# Altium schematic sheet driver_sapog_compact.SchDoc
size A0; Organization: Altium Limited; Address1: L3, 12a Rodborough Rd; Address2: Frenchs Forest; Address3: NSW; Address4: Australia 2086
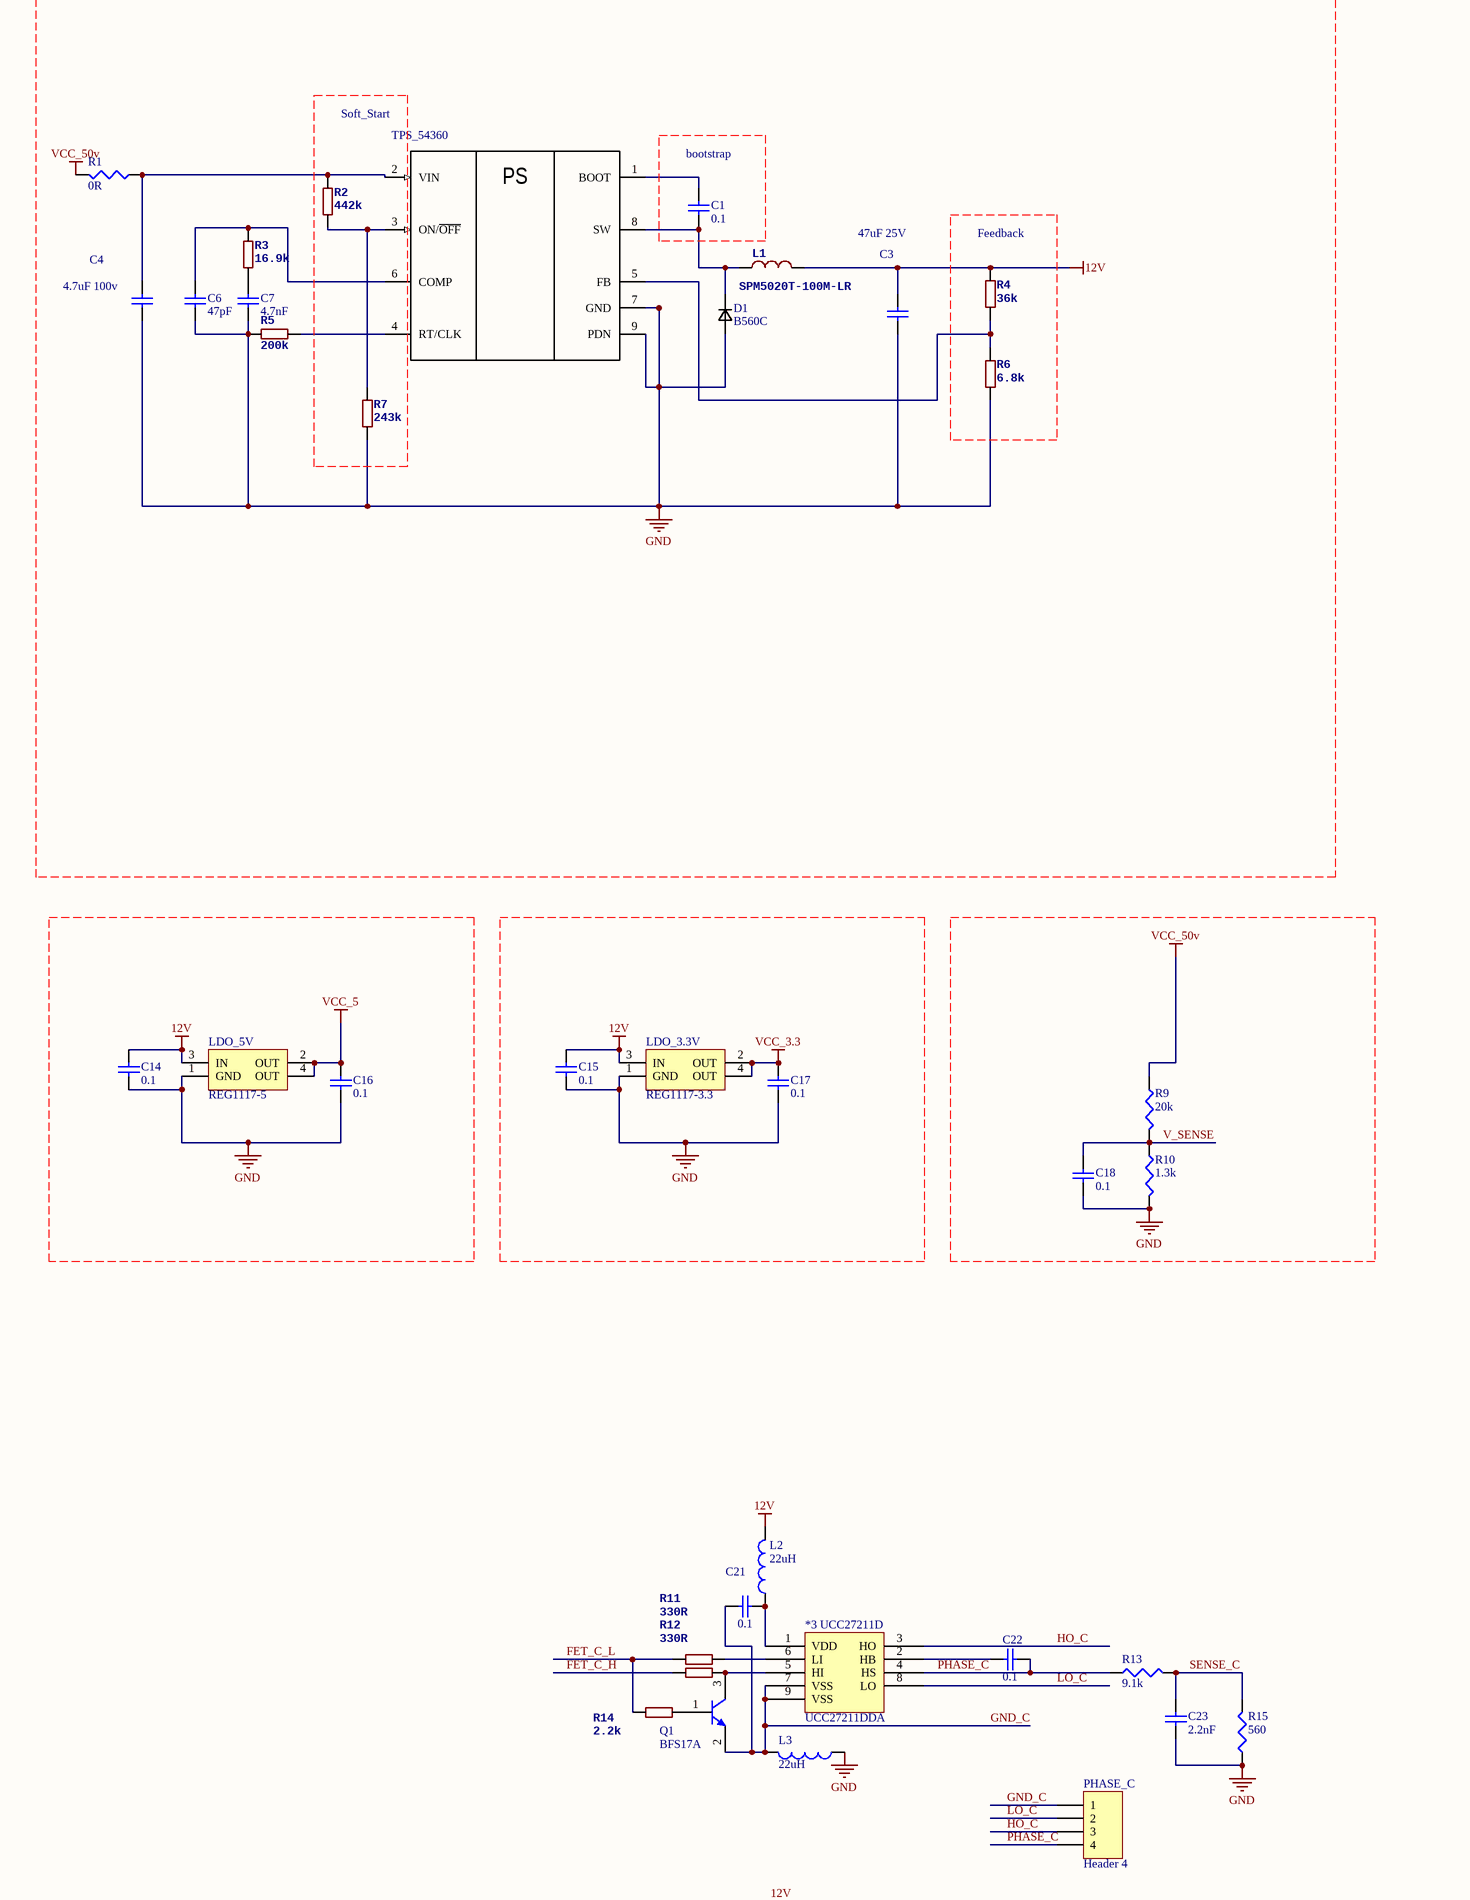
[diagram p0: driver_sapog_compact.SchDoc, top left]
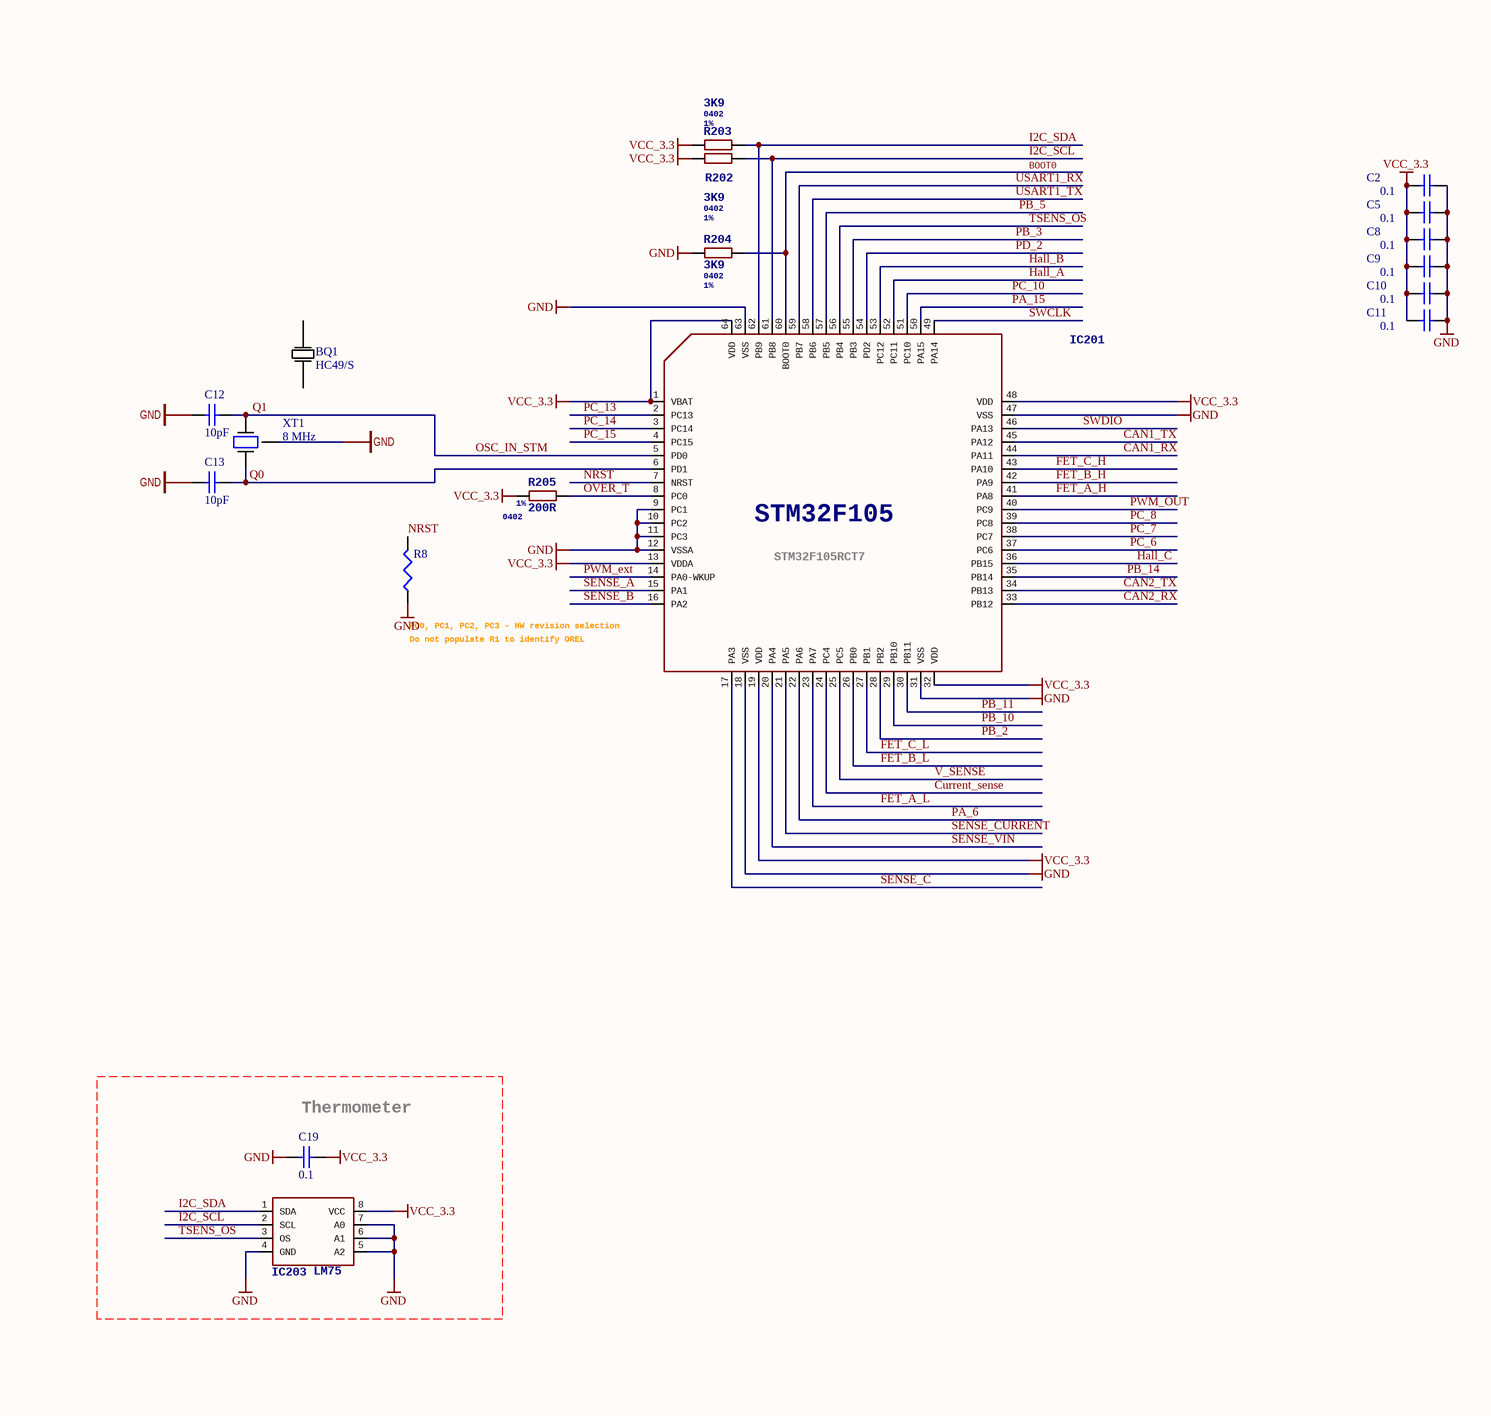
[diagram p1: driver_sapog_compact.SchDoc, top middle]
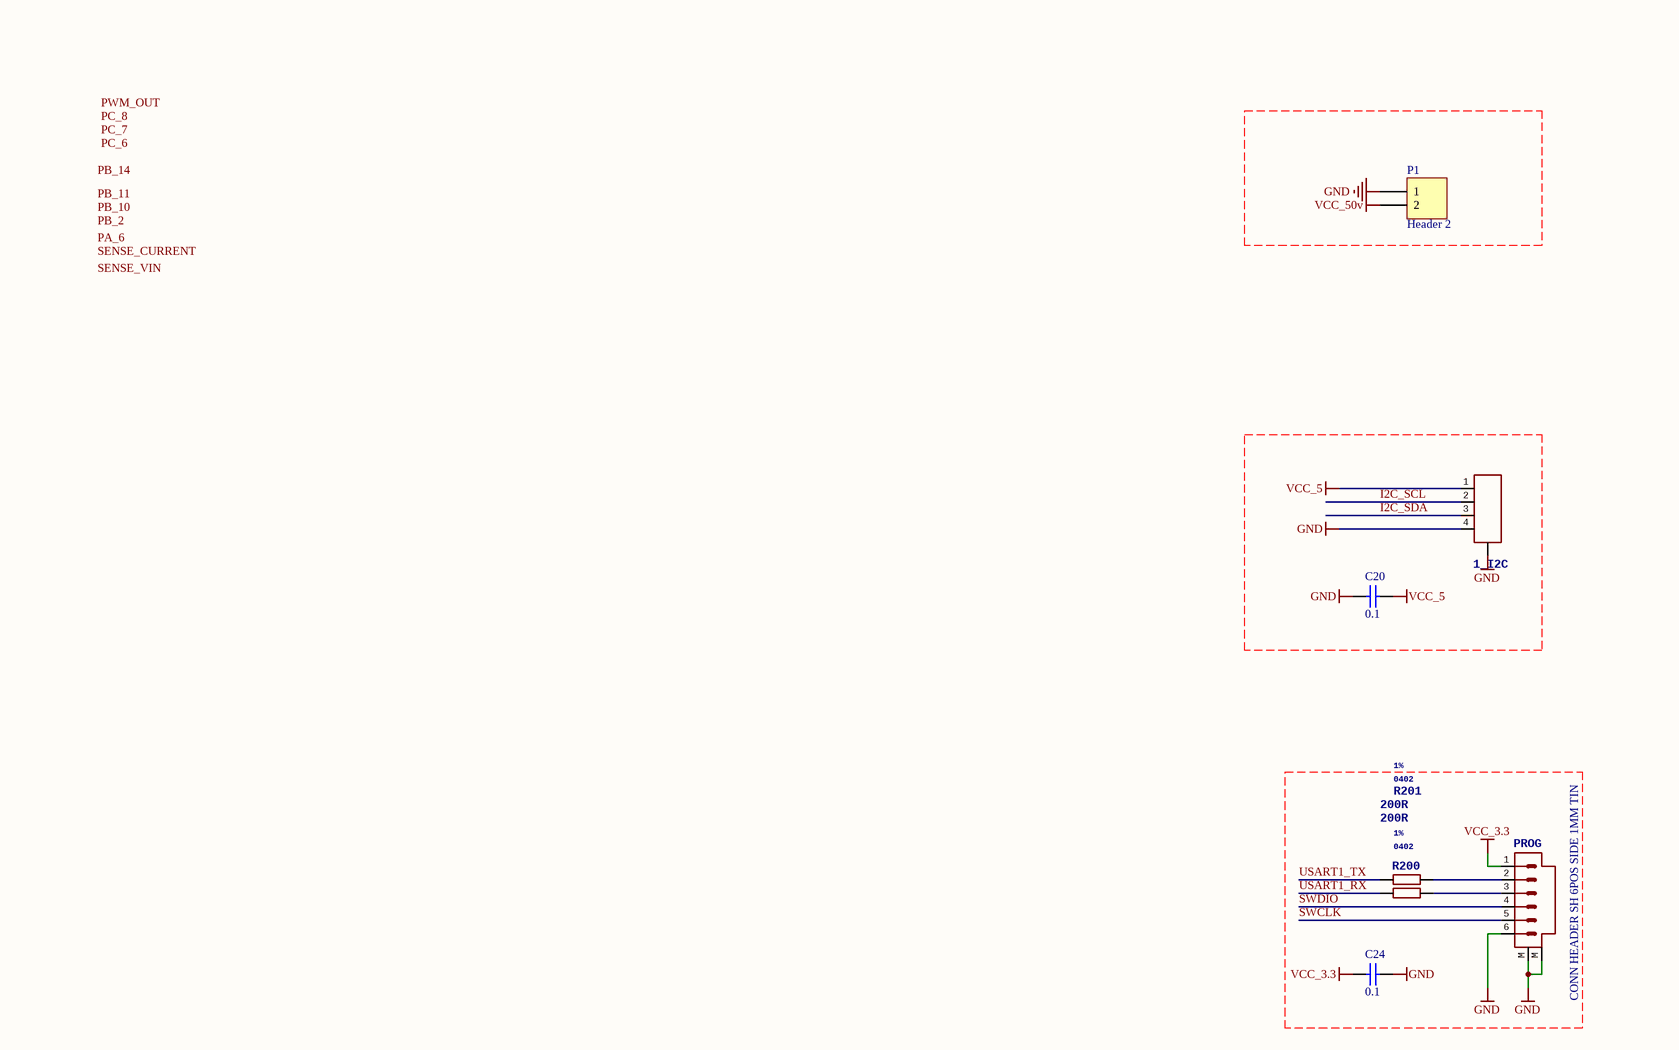
[diagram p2: driver_sapog_compact.SchDoc, top right]
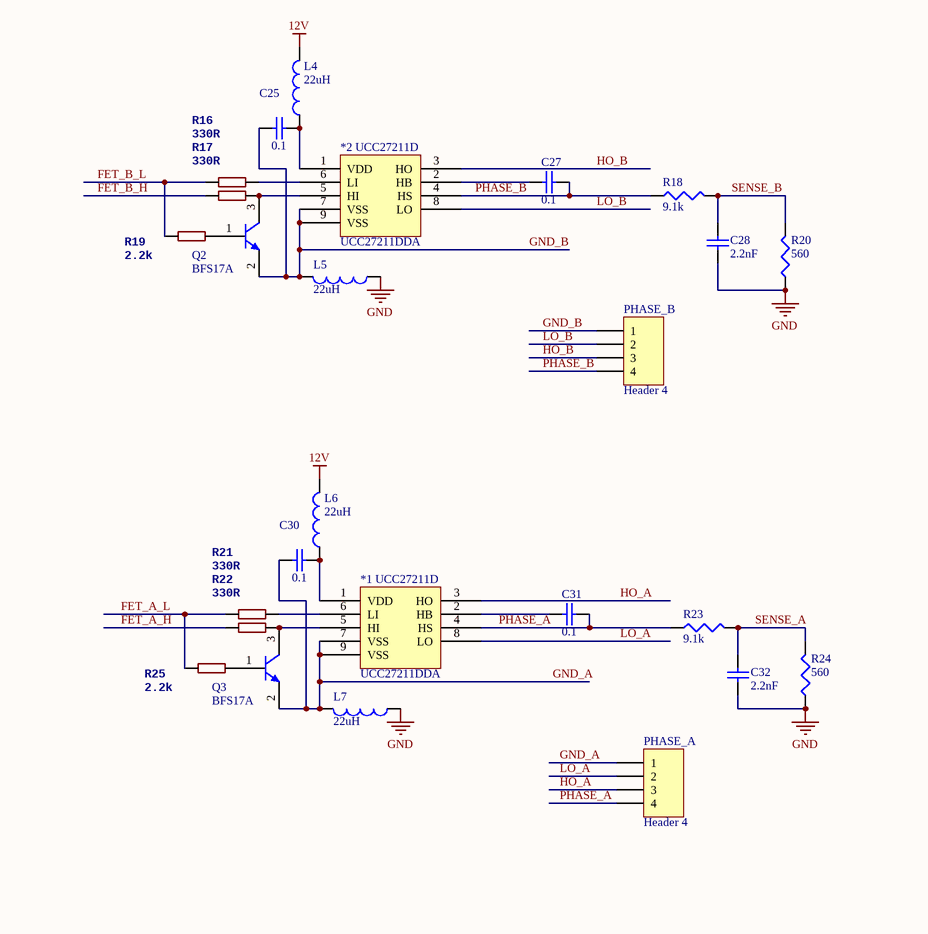
[diagram p3: driver_sapog_compact.SchDoc, bottom left]
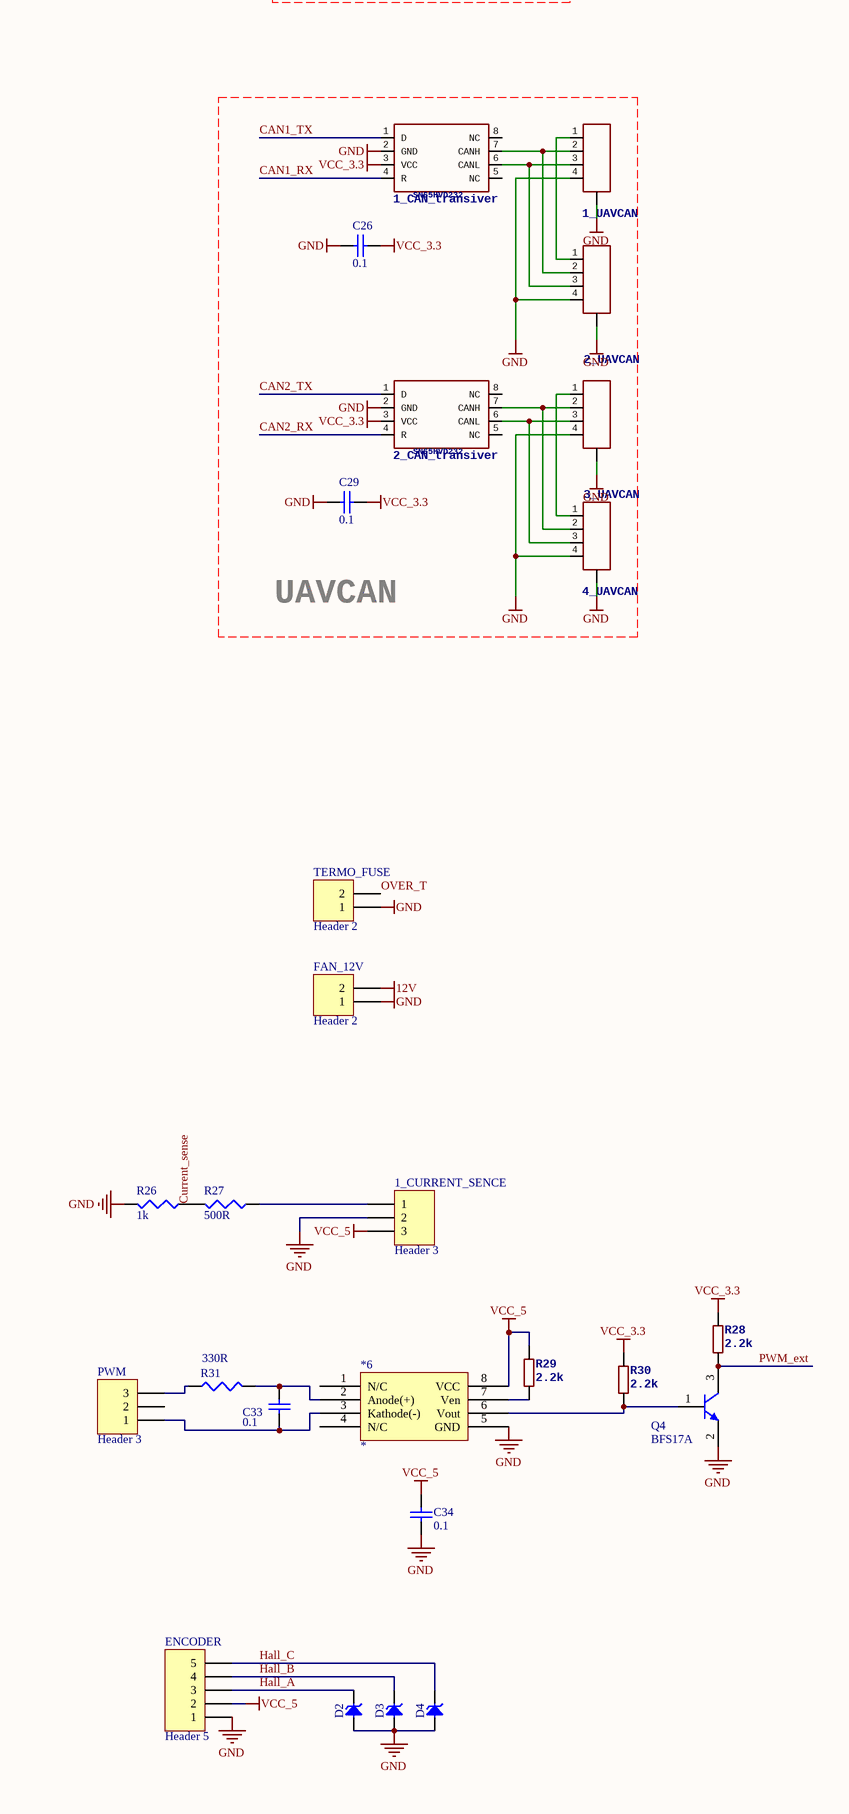
[diagram p4: driver_sapog_compact.SchDoc, bottom right]

## Parts
1_CAN_transiver  SN65HVD232D  [SOIC8]  (value not drawn)
1_CURRENT_SENCE  Header 3  [HDR1X3]
1_I2C  CON-4P-RA  [JST_GH-4P-RA]  (value not drawn)
1_UAVCAN  CON-4P-RA  [JST_GH-4P-RA]  (value not drawn)
2_CAN_transiver  SN65HVD232D  [SOIC8]  (value not drawn)
2_UAVCAN  CON-4P-RA  [JST_GH-4P-RA]  (value not drawn)
3_UAVCAN  CON-4P-RA  [JST_GH-4P-RA]  (value not drawn)
4_UAVCAN  CON-4P-RA  [JST_GH-4P-RA]  (value not drawn)
*1_UCC27211D  UCC27211DDA  [D8_L_G]
*2_UCC27211D  UCC27211DDA  [D8_L_G]
*3_UCC27211D  UCC27211DDA  [D8_L_G]
*6  *  [UCC37322P]
BQ1  HC49/S  [HS49/S]
C1  0.1  [1608[0603]]
C2  0.1  [SMT0603/VISHAY]
C3  value 47uF 25V  [2220]  (hidden comment: 1206)
C4  value 4.7uF 100v  [2220]  (hidden comment: 2220)
C5  0.1  [SMT0603/VISHAY]
C6  47pF  [SMT0603/VISHAY]
C7  4.7nF  [SMT0603/VISHAY]
C8  0.1  [SMT0603/VISHAY]
C9  0.1  [SMT0603/VISHAY]
C10  0.1  [SMT0603/VISHAY]
C11  0.1  [SMT0603/VISHAY]
C12  10pF  [SMT0603/VISHAY]
C13  10pF  [SMT0603/VISHAY]
C14  0.1  [SMT0603/VISHAY]
C15  0.1  [SMT0603/VISHAY]
C16  0.1  [SMT0603/VISHAY]
C17  0.1  [SMT0603/VISHAY]
C18  0.1  [SMT0603/VISHAY]
C19  0.1  [SMT0603/VISHAY]
C20  0.1  [SMT0603/VISHAY]
C21  0.1  [2220]
C22  0.1  [2220]
C23  2.2nF  [SMT0603/VISHAY]
C24  0.1  [SMT0603/VISHAY]
C25  0.1  [2220]
C26  0.1  [SMT0603/VISHAY]
C27  0.1  [2220]
C28  2.2nF  [SMT0603/VISHAY]
C29  0.1  [SMT0603/VISHAY]
C30  0.1  [2220]
C31  0.1  [2220]
C32  2.2nF  [SMT0603/VISHAY]
C33  0.1  [SMT0603/VISHAY]
C34  0.1  [SMT0603/VISHAY]
D1  B560C  [SMC]
D2  BZV55-B13  [3.2x1.6x1.1]  (value not drawn)
D3  BZV55-B13  [3.2x1.6x1.1]  (value not drawn)
D4  BZV55-B13  [3.2x1.6x1.1]  (value not drawn)
ENCODER  Header 5  [jst_gh_6_pin]
FAN_12V  Header 2  [HDR1X2]
IC201  STM32F105  [TQFP64-10X10]
IC203  LM75BD-TSSOP8  [TSSOP8]  (value not drawn)
L1  SPM5020T-100M-LR  [Inductor]
L2  22uH  [0805]
L3  22uH  [0805]
L4  22uH  [0805]
L5  22uH  [0805]
L6  22uH  [0805]
L7  22uH  [0805]
LDO_3.3V  REG1117-3.3  [ZZ311]
LDO_5V  REG1117-5  [ZZ311]
P1  Header 2  [HDR1X2]
PHASE_A  Header 4  [HDR1X4]
PHASE_B  Header 4  [HDR1X4]
PHASE_C  Header 4  [HDR1X4]
PROG  CONN HEADER SH 6POS SIDE 1MM TIN  [HIROSE DF13-6P-1.25H]
PWM  Header 3  [HDR1X3]
Q1  BFS17A  [SOT-23_N]
Q2  BFS17A  [SOT-23_N]
Q3  BFS17A  [SOT-23_N]
Q4  BFS17A  [SOT-23_N]
R1  value 0R  [14-1210]  (hidden comment: 1210)
R2  442k  [SMT0603/VISHAY]
R3  16.9k  [SMT0603/VISHAY]
R4  36k  [SMT0603/VISHAY]
R5  200k  [SMT0603/VISHAY]
R6  6.8k  [SMT0603/VISHAY]
R7  243k  [SMT0603/VISHAY]
R8  Res3  [SMT0603/VISHAY]  (value not drawn)
R9  value 20k  [SMT0603/VISHAY]  (hidden comment: 10k)
R10  value 1.3k  [SMT0603/VISHAY]  (hidden comment: 1k)
R11  330R  [1608[0603]]
R12  330R  [1608[0603]]
R13  9.1k  [SMT0603/VISHAY]
R14  2.2k  [1608[0603]]
R15  value 560  [SMT0603/VISHAY]  (hidden comment: 560R)
R16  330R  [1608[0603]]
R17  330R  [1608[0603]]
R18  9.1k  [SMT0603/VISHAY]
R19  2.2k  [1608[0603]]
R20  value 560  [SMT0603/VISHAY]  (hidden comment: 560R)
R21  330R  [1608[0603]]
R22  330R  [1608[0603]]
R23  9.1k  [SMT0603/VISHAY]
R24  value 560  [SMT0603/VISHAY]  (hidden comment: 560R)
R25  2.2k  [1608[0603]]
R26  1k  [SMT0603/VISHAY]
R27  value 500R  [SMT0603/VISHAY]  (hidden comment: 560R)
R28  2.2k  [1608[0603]]
R29  2.2k  [1608[0603]]
R30  2.2k  [1608[0603]]
R31  330R  [SMT0603/VISHAY]
R200  200R  PACKAGE: 0402  TOLERANCE: 1%  [SMT0603/VISHAY]
R201  200R  PACKAGE: 0402  TOLERANCE: 1%  [SMT0603/VISHAY]
R202  3K9  PACKAGE: 0402  TOLERANCE: 1%  [SMT0603/VISHAY]
R203  3K9  PACKAGE: 0402  TOLERANCE: 1%  [SMT0603/VISHAY]
R204  3K9  PACKAGE: 0402  TOLERANCE: 1%  [SMT0603/VISHAY]
R205  200R  PACKAGE: 0402  TOLERANCE: 1%  [SMT0603/VISHAY]
TERMO_FUSE  Header 2  [HDR1X2]
TPS_54360  (no value)  [D8_L_G]
XT1  8 MHz  [DFN220P320X110-4N]

## Nets
12V: C3.2 C14.2 C15.2 FAN_12V.2 L1.2 L2.2 L4.2 L6.2 LDO_3.3V.3(IN) LDO_5V.3(IN) R4.2
GND: 1_CAN_transiver.2(GND) 1_CURRENT_SENCE.2 1_I2C.4 1_I2C.M$0_M$1(GND) 1_UAVCAN.4 1_UAVCAN.M$0_M$1(GND) 2_CAN_transiver.2(GND) 2_UAVCAN.4 2_UAVCAN.M$0_M$1(GND) 3_UAVCAN.4 3_UAVCAN.M$0_M$1(GND) 4_UAVCAN.4 4_UAVCAN.M$0_M$1(GND) *6.5(GND) C2.1 C3.1 C4.1 C5.1 C6.2 C7.2 C8.1 C9.1 C10.1 C11.1 C12.1 C13.1 C14.1 C15.1 C16.1 C17.1 C18.1 C19.2 C20.1 C23.2 C24.2 C26.1 C28.2 C29.2 C32.2 C34.1 D1.1 D2.2(A) D3.2(A) D4.2(A) ENCODER.1 FAN_12V.1 IC201.9(PC1) IC201.10(PC2) IC201.11(PC3) IC201.12(VSSA) IC201.18(VSS) IC201.31(VSS) IC201.47(VSS) IC201.63(VSS) IC203.4(GND) IC203.5(A2) IC203.6(A1) IC203.7(A0) L3.1 L5.1 L7.1 LDO_3.3V.1(GND) LDO_5V.1(GND) P1.1 PROG.6 PROG.M Q4.2(E) R5.2 R6.1 R7.1 R8.1 R10.2 R15.1 R20.1 R24.1 R26.2 R204.1 TERMO_FUSE.1 TPS_54360.7(GND) TPS_54360.9(PDN) XT1.G
VCC_3.3: 1_CAN_transiver.3(VCC) 2_CAN_transiver.3(VCC) C2.2 C5.2 C8.2 C9.2 C10.2 C11.2 C17.2 C19.1 C24.1 C26.2 C29.1 IC201.1(VBAT) IC201.13(VDDA) IC201.19(VDD) IC201.32(VDD) IC201.48(VDD) IC201.64(VDD) IC203.8(VCC) LDO_3.3V.2(OUT) LDO_3.3V.4(OUT) PROG.1 R28.1 R30.1 R202.1 R203.1 R205.2
VCC_5: 1_CURRENT_SENCE.3 1_I2C.1 *6.8(VCC) C16.2 C20.2 C34.2 ENCODER.2 LDO_5V.2(OUT) LDO_5V.4(OUT) R29.1
VCC_50v: P1.2 R1.2 R9.1
BOOT0: IC201.60(BOOT0) R204.2
CAN1_RX: 1_CAN_transiver.4(R) IC201.44(PA11)
CAN1_TX: 1_CAN_transiver.1(D) IC201.45(PA12)
CAN2_RX: 2_CAN_transiver.4(R) IC201.33(PB12)
CAN2_TX: 2_CAN_transiver.1(D) IC201.34(PB13)
Current_sense: IC201.24(PC4) R26.1 R27.2
FET_A_H: IC201.41(PA8) R21.2
FET_A_L: IC201.23(PA7) R22.2 R25.2
FET_B_H: IC201.42(PA9) R16.2
FET_B_L: IC201.26(PB0) R17.2 R19.2
FET_C_H: IC201.43(PA10) R11.2
FET_C_L: IC201.27(PB1) R12.2 R14.2
GND_A: *1_UCC27211D.7(VSS) *1_UCC27211D.9(VSS) C30.2 L7.2 PHASE_A.1 Q3.2(E)
GND_B: *2_UCC27211D.7(VSS) *2_UCC27211D.9(VSS) C25.2 L5.2 PHASE_B.1 Q2.2(E)
GND_C: *3_UCC27211D.7(VSS) *3_UCC27211D.9(VSS) C21.2 L3.2 PHASE_C.1 Q1.2(E)
Hall_A: D2.1(C) ENCODER.3 IC201.52(PC11)
Hall_B: D3.1(C) ENCODER.4 IC201.53(PC12)
Hall_C: D4.1(C) ENCODER.5 IC201.36(PB15)
HO_A: *1_UCC27211D.3(HO) PHASE_A.3
HO_B: *2_UCC27211D.3(HO) PHASE_B.3
HO_C: *3_UCC27211D.3(HO) PHASE_C.3
I2C_SCL: 1_I2C.2 IC201.61(PB8) IC203.2(SCL) R202.2
I2C_SDA: 1_I2C.3 IC201.62(PB9) IC203.1(SDA) R203.2
LO_A: *1_UCC27211D.8(LO) PHASE_A.2
LO_B: *2_UCC27211D.8(LO) PHASE_B.2
LO_C: *3_UCC27211D.8(LO) PHASE_C.2
NRST: IC201.7(NRST) R8.2
OSC_IN_STM: C12.2 IC201.5(PD0) XT1.3  [also labelled Q1]
OVER_T: IC201.8(PC0) R205.1 TERMO_FUSE.2
PA_6: IC201.22(PA6)
PA_15: IC201.50(PA15)
PB_2: IC201.28(PB2)
PB_3: IC201.55(PB3)
PB_5: IC201.57(PB5)
PB_10: IC201.29(PB10)
PB_11: IC201.30(PB11)
PB_14: IC201.35(PB14)
PC_6: IC201.37(PC6)
PC_7: IC201.38(PC7)
PC_8: IC201.39(PC8)
PC_10: IC201.51(PC10)
PC_13: IC201.2(PC13)
PC_14: IC201.3(PC14)
PC_15: IC201.4(PC15)
PD_2: IC201.54(PD2)
PHASE_A: *1_UCC27211D.4(HS) C31.2 PHASE_A.4 R23.1
PHASE_B: *2_UCC27211D.4(HS) C27.2 PHASE_B.4 R18.1
PHASE_C: *3_UCC27211D.4(HS) C22.2 PHASE_C.4 R13.1
PWM_ext: IC201.14(PA0-WKUP) Q4.3(C) R28.2
PWM_OUT: IC201.40(PC9)
Q0: C13.2 IC201.6(PD1) XT1.1
SENSE_A: C32.1 IC201.15(PA1) R23.2 R24.2
SENSE_B: C28.1 IC201.16(PA2) R18.2 R20.2
SENSE_C: C23.1 IC201.17(PA3) R13.2 R15.2
SENSE_CURRENT: IC201.21(PA5)
SENSE_VIN: IC201.20(PA4)
SWCLK: IC201.49(PA14) PROG.5
SWDIO: IC201.46(PA13) PROG.4
TSENS_OS: IC201.56(PB4) IC203.3(OS)
USART1_RX: IC201.59(PB7) R201.2
USART1_TX: IC201.58(PB6) R200.2
V_SENSE: C18.2 IC201.25(PC5) R9.2 R10.1
Net1_CAN_transiver_6: 1_CAN_transiver.6(CANL) 1_UAVCAN.3 2_UAVCAN.3
Net1_CAN_transiver_7: 1_CAN_transiver.7(CANH) 1_UAVCAN.2 2_UAVCAN.2
Net1_CURRENT_SENCE_1: 1_CURRENT_SENCE.1 R27.1
Net1_UAVCAN_1: 1_UAVCAN.1 2_UAVCAN.1
Net2_CAN_transiver_6: 2_CAN_transiver.6(CANL) 3_UAVCAN.3 4_UAVCAN.3
Net2_CAN_transiver_7: 2_CAN_transiver.7(CANH) 3_UAVCAN.2 4_UAVCAN.2
Net3_UAVCAN_1: 3_UAVCAN.1 4_UAVCAN.1
Net*1_UCC27211D_1: *1_UCC27211D.1(VDD) C30.1 L6.1
Net*1_UCC27211D_2: *1_UCC27211D.2(HB) C31.1
Net*1_UCC27211D_5: *1_UCC27211D.5(HI) Q3.3(C) R21.1
Net*1_UCC27211D_6: *1_UCC27211D.6(LI) R22.1
Net*2_UCC27211D_1: *2_UCC27211D.1(VDD) C25.1 L4.1
Net*2_UCC27211D_2: *2_UCC27211D.2(HB) C27.1
Net*2_UCC27211D_5: *2_UCC27211D.5(HI) Q2.3(C) R16.1
Net*2_UCC27211D_6: *2_UCC27211D.6(LI) R17.1
Net*3_UCC27211D_1: *3_UCC27211D.1(VDD) C21.1 L2.1
Net*3_UCC27211D_2: *3_UCC27211D.2(HB) C22.1
Net*3_UCC27211D_5: *3_UCC27211D.5(HI) Q1.3(C) R11.1
Net*3_UCC27211D_6: *3_UCC27211D.6(LI) R12.1
Net*6_2: *6.2(Anode(+)) C33.2 R31.2
Net*6_3: *6.3(Kathode(-)) C33.1 PWM.1
Net*6_6: *6.6(Vout) Q4.1(B) R30.2
Net*6_7: *6.7(Ven) R29.2
NetC1_1: C1.1 TPS_54360.1(BOOT)
NetC1_2: C1.2 D1.2 L1.1 TPS_54360.8(SW)
NetC4_2: C4.2 R1.1 R2.2 TPS_54360.2(VIN)
NetC6_1: C6.1 R3.2 TPS_54360.6(COMP)
NetC7_1: C7.1 R3.1
NetPROG_2: PROG.2 R200.1
NetPROG_3: PROG.3 R201.1
NetPWM_3: PWM.3 R31.1
NetQ1_1: Q1.1(B) R14.1
NetQ2_1: Q2.1(B) R19.1
NetQ3_1: Q3.1(B) R25.1
NetR2_1: R2.1 R7.2 TPS_54360.3(ON/~{OFF})
NetR4_1: R4.1 R6.2 TPS_54360.5(FB)
NetR5_1: R5.1 TPS_54360.4(RT/CLK)

Not connected (* = marked no-connect by the designer): 1_CAN_transiver 5(NC) 8(NC); 2_CAN_transiver 5(NC) 8(NC); *6 1(N/C) 4(N/C); BQ1 1 2; PWM 2

## Notes on the sheet
- Soft_Start
- (near C1) bootstrap
- (near R4) Feedback
- (near IC201) STM32F105RCT7
- (near R8) PC0, PC1, PC2, PC3 - HW revision selection
- (near R8) Do not populate R1 to identify OREL
- (near C19) Thermometer
- UAVCAN
- Labels drawn without touching a wire or pin: PA_6, PB_2, PB_10, PB_11, PB_14, PC_6, PC_7, PC_8, PWM_OUT, SENSE_CURRENT, SENSE_VIN
- Title
- Size:
- Date:
- File:
- A0
- Number:
- Time:
- Revision:
- Sheet
- of
- (in symbol TPS54560) PS

## Library data of the parts
1_CAN_transiver 2_CAN_transiver = SN65HVD232D: IC CAN TRANSCEIVER 3.3V 8-SOIC; MANF: Texas Instruments; MANF#: SN65HVD232DR; DIGIKEY#: 296-26344-1-ND; SN65HVD232: SN65HVD232
1_CURRENT_SENCE PWM = Header 3: Header, 3-Pin; LatestRevisionDate: 17-Jul-2002; LatestRevisionNote: Re-released for DXP Platform.; Publisher: Altium Limited
1_I2C 1_UAVCAN 2_UAVCAN 3_UAVCAN 4_UAVCAN = CON-4P-RA: Connector Receptacle 4 Position 0.049" (1.25mm) Tin Surface Mount, Right Angle; pin to pad: M$0 M$1>M M; MANF: Molex; MANF#: 5023860470; DIGIKEY#: WM4948CT-ND
*6 = Component_1
BQ1 = HC49/S: Crystal Oscillator; PackageReference: hs_49u
C1 C2 C5-C34 = Cap Semi: Capacitor (Semiconductor SIM Model); Value: 100nF; Published: 8-Jun-2000; LatestRevisionDate: 29-May-2009; LatestRevisionNote: IPC-7351 Footprint Added.; PackageReference: C1206; Publisher: Altium Limited; PackageDescription: Chip Capacitor
C3 = Cap Semi: 100uF; Published: 8-Jun-2000; LatestRevisionDate: 29-May-2009; LatestRevisionNote: IPC-7351 Footprint Added.; PackageReference: C1206; Publisher: Altium Limited; PackageDescription: Chip Capacitor
C4 = Cap Semi: 4.7uF 100v; Published: 8-Jun-2000; LatestRevisionDate: 29-May-2009; LatestRevisionNote: IPC-7351 Footprint Added.; PackageReference: C2220; Publisher: Altium Limited; PackageDescription: Chip Capacitor
D1 = B560C: 60V 0.5A Shottcky Diode
D2-D4 = BZV55-B13: Zener Diode; pin to pad: 1>2 2>1; Part Description: Voltage Regulator Diode; Manufacturer: NXP SEMICONDUCTORS; Voltage: 13V; Power: 500mW; Table: Diodes; Part Number: BZV55-B13; Component Kind: Standard; Component Type: Standard; Device: BZV55-B13; Footprint: DIOMELF3515N; PackageDescription: SOD80C, MELF Diode, 2-Leads, Body 3.5x1.5mm, IPC Medium Density; Manufacturer Part Number: BZV55-B13; Pin Count: 2; Case: SOD-80C; Mounted: Yes; Socket: No; SMD: Yes; ComponentHeight: 1.6mm; HelpURL: \\cern.ch\dfs\Applications\Altium\Datasheets\BZV55.pdf; Author: CERN DEM JLC; CreateDate: 06/05/2008; LatestRevisionDate: 06/05/2008
ENCODER = Header 5: Header, 5-Pin; pin to pad: 1>6 2>5 3>4 4>3 5>2; LatestRevisionDate: 17-Jul-2002; LatestRevisionNote: Re-released for DXP Platform.; Publisher: Altium Limited
FAN_12V P1 TERMO_FUSE = Header 2: Header, 2-Pin; LatestRevisionDate: 17-Jul-2002; LatestRevisionNote: Re-released for DXP Platform.; Publisher: Altium Limited
IC201 = STM32F105: MCU ARM 256KB FLASH MEM 64-LQFP; MANF: STMicroelectronics; MANF#: STM32F105RCT6; OPERATING_TEMP: -40°C ~ 105°C (TA); DIGIKEY#: 497-8918-ND; STM32F105: STM32F105
IC203 = LM75BD-TSSOP8: SENSOR TEMPERATURE I2C 8TSSOP; MANF: NXP Semiconductors; MANF#: LM75BDP,118; DIGIKEY#: 568-4768-1-ND; LM75: LM75
L1 = L-EPCOS_B82464
L2-L7 = Inductor: 0805; Code_IEC: 1005; Published: 8-Jun-2000; LatestRevisionDate: 29-May-2009; LatestRevisionNote: IPC-7351 Footprint Added.; PackageReference: 0402-A; Publisher: Altium Limited; PackageDescription: Chip Inductor; Code_JEITA: 0402; Value: 22uH
LDO_3.3V LDO_5V = REG1117-5: 800mA and 1A Low Dropout Positive Regulator 2.85V, 3.3V, 5V, and Adjustable; Published: 8-Jun-2000; LatestRevisionDate: 17-Jul-2002; LatestRevisionNote: Re-released for DXP Platform.; DatasheetVersion: Sep-1997; PackageVersion: revC; PackageReference: ZZ311; Publisher: Altium Limited; PackageDescription: SOT-223/SC-73; 4 Leads; Body 6.7 x 7.3 mm, inc. leads (LxW max); ComponentLink1Description: Manufacturer Link; ComponentLink1URL: http://www.ti.com/; ComponentLink2Description: Datasheet; ComponentLink2URL: http://www-s.ti.com/sc/ds/REG1117.pdf
PHASE_A PHASE_B PHASE_C = Header 4: Header, 4-Pin; LatestRevisionDate: 17-Jul-2002; LatestRevisionNote: Re-released for DXP Platform.; Publisher: Altium Limited
PROG = DF13_6P_1: pin to pad: M>8; MANF: JST Sales America Inc; MANF#: SM06B-SRSS-TB(LF)(SN); DIGIKEY#: 455-1806-1-ND
Q1-Q4 = 2N3904: NPN General Purpose Amplifier; Published: 8-Jun-2000; LatestRevisionDate: 15-Jan-2003; LatestRevisionNote: PCB Footprint 'BCY-W3/D4.7' replaced; DatasheetVersion: 1997; PackageVersion: Sep-1998; PackageReference: TO-92A; Publisher: Altium Limited; PackageDescription: TO, Flat Index; 3 In-Line, Axial Leads; Body Dia. 4.5mm; Leads 0.51 x 0.48 mm (max); ComponentLink1Description: Manufacturer Link; ComponentLink1URL: http://www.fairchildsemi.com/; ComponentLink2Description: Datasheet; ComponentLink2URL: http://www.fairchildsemi.com/ds/2N%2F2N3904.pdf
R1 = Res3: fuse; Published: 8-Jun-2000; LatestRevisionDate: 29-May-2009; LatestRevisionNote: IPC-7351 Footprint Added.; PackageReference: J1-0603; Publisher: Altium Limited; PackageDescription: Chip Resistor
R2-R7 R11 R12 R14 R16 R17 R19 R21 R22 R25 R28-R30 = R0402
R8-R10 R13 R15 R18 R20 R23 R24 R26 R27 R31 = Res3: Resistor; Published: 8-Jun-2000; LatestRevisionDate: 29-May-2009; LatestRevisionNote: IPC-7351 Footprint Added.; PackageReference: J1-0603; Publisher: Altium Limited; PackageDescription: Chip Resistor
  R13 R18 R23: Value: 9.1k
  R26: Value: 1k
  R31: Value: 330R
R200 R201 = 200R-0402: PARTNO: RC0402FR-07240RL; MANF: Yageo; MANF#: RC0402FR-07200RL; DIGIKEY#: 311-200LRCT-ND; VALUE: 200R
R202-R204 = 3K9-0402: MANF: Yageo; MANF#: RC0402FR-073K9L; DIGIKEY#: 311-3.90KLRCT-ND; VALUE: 3K9
R205 = 200R-0402: ASSEMBLY: DNM; MANF: Yageo; MANF#: RC0402FR-07200RL; DIGIKEY#: 311-200LRCT-ND; VALUE: 200R
TPS_54360 = TPS54560: 150mA Low-Noise Low-Dropout Regulator Whit Shutdown
XT1 = ABM3B-8.000MHZ-10-1-U-T: FA-238 16.0000MB-C3; Manufacturer: Abracon LLC; Frequency Stability: ±10ppm; Load Capacitance: 10pF; Operating Mode: Fundamental; Value: 8 MHz; Supplier 1: Digi-Key; Supplier Part Number 1: 535-9721-1-ND; RoHS: RoHS Compliant; Category: Crystals, Oscillators, Resonators; Stock: 35437; Pricing 1: 1=0.69, 10=0.578, 50=0.5198, 100=0.462, 500=0.4389 (USD); Packaging: Cut Tape (CT); Part Status: Active; Type: MHz Crystal; Frequency Tolerance: ±10ppm; Operating Temperature: -10°C ~ 60°C; Ratings: -; Mounting Type: Surface Mount; Package / Case: 4-SMD, No Lead; Size / Dimension: 0.197" L x 0.126" W (5.00mm x 3.20mm); Height - Seated (Max): 0.043" (1.10mm); ComponentLink1URL: http://www.abracon.com/Resonators/abm3b.pdf; ComponentLink1Description: http://www.abracon.com/Resonators/abm3b.pdf; Supplier 2: Digi-Key; Supplier Part Number 2: 535-9721-2-ND; Pricing 2: 1000=0.336, 3000=0.315, 5000=0.3045, 10000=0.294 (USD); Manufacturer Part Number: ABM3B-8.000MHZ-10-1-U-T